# Altium project MIOS-Emphase.PrjPCB
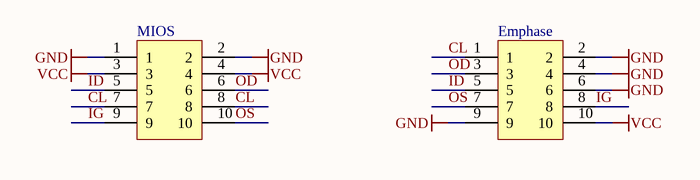
[diagram p0: MIOS-Emphase.SchDoc]
1 sheet, 2 parts. Net scope: global (net labels, ports and power ports of the same name join across sheets).
Board file: MIOS-Emphase.PcbDoc

## Sheet MIOS-Emphase.SchDoc
size A4

### Parts
Emphase  10 pol Header  [10 pol Header]  (value not drawn)
MIOS  10 pol Header  [10 pol Header]  (value not drawn)

### Nets
GND: Emphase.2 Emphase.4 Emphase.6 Emphase.9 MIOS.1 MIOS.2
VCC: Emphase.10 MIOS.3 MIOS.4
CL: Emphase.1 MIOS.7 MIOS.8
ID: Emphase.5 MIOS.5
IG: Emphase.8 MIOS.9
OD: Emphase.3 MIOS.6
OS: Emphase.7 MIOS.10

### Library data of the parts
Emphase MIOS = 10 pol Header: LatestRevisionDate: 2012-06-14; Publisher: NONLINEAR LABS